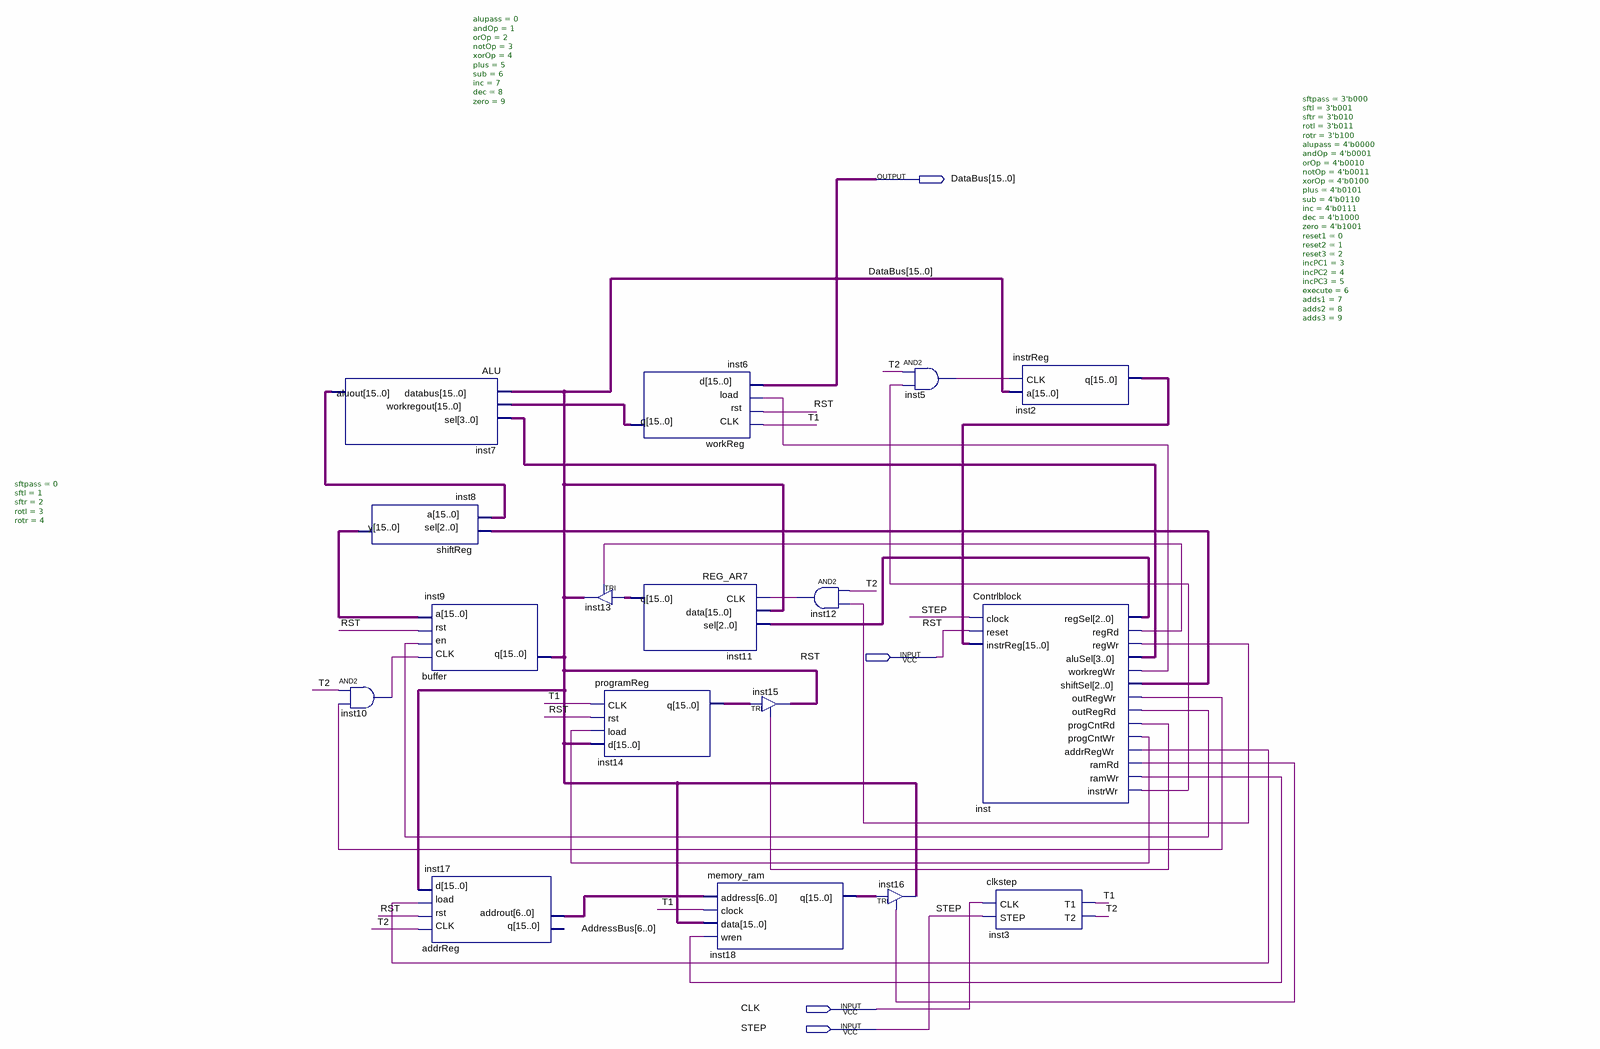
[diagram p0: schematic sheet]
// Quartus schematic CPU16bit(1).bdf as structural Verilog: 17 symbols, 4 pins
module \CPU16bit(1)  (
  input  RST,
  input  CLK,
  input  STEP,
  output [15:0] DataBus
);

  wire inst5_out, inst10_out, inst12_out, inst_addrregwr, inst_instrwr, inst_outregrd, inst_outregwr,
       inst_progcntrd, inst_progcntwr, inst_ramrd, inst_ramwr, inst_regrd, inst_regwr, inst_workregwr, T1, T2;
  wire [2:0] inst_regsel, inst_shiftsel;
  wire [3:0] inst_alusel;
  wire [6:0] AddressBus;
  wire [15:0] inst2_q, inst6_q, inst7_aluout, inst8_y, inst11_q, inst14_q, inst18_q;

  ALU #(.alupass(0), .andOp(1), .orOp(2), .notOp(3), .xorOp(4), .plus(5), .sub(6), .inc(7), .dec(8), .zero(9)) inst7 (
    .databus(DataBus), .workregout(inst6_q), .sel(inst_alusel), .aluout(inst7_aluout));
  shiftReg #(.sftpass(0), .sftl(1), .sftr(2), .rotl(3), .rotr(4)) inst8 (
    .sel(inst_shiftsel), .a(inst7_aluout), .y(inst8_y));
  and inst10 (inst10_out, T2, inst_outregwr);
  buffer inst9 (.CLK(inst10_out), .en(inst_outregrd), .rst(RST), .a(inst8_y), .q(DataBus));
  addrReg inst17 (.CLK(T2), .rst(RST), .load(inst_addrregwr), .d(DataBus), .addrout(AddressBus));  // open: q
  TRI inst13[15:0] (.IN(inst11_q), .OE(inst_regrd), .OUT(DataBus));
  programReg inst14 (.CLK(T1), .rst(RST), .load(inst_progcntwr), .d(DataBus), .q(inst14_q));
  workReg inst6 (.CLK(T1), .rst(RST), .load(inst_workregwr), .d(DataBus), .q(inst6_q));
  REG_AR7 inst11 (.CLK(inst12_out), .data(DataBus), .sel(inst_regsel), .q(inst11_q));
  memory_ram inst18 (.address(AddressBus), .clock(T1), .data(DataBus), .wren(inst_ramwr), .q(inst18_q));
  TRI inst15[15:0] (.IN(inst14_q), .OE(inst_progcntrd), .OUT(DataBus));
  and inst12 (inst12_out, T2, inst_regwr);
  and inst5 (inst5_out, T2, inst_instrwr);
  TRI inst16[15:0] (.IN(inst18_q), .OE(inst_ramrd), .OUT(DataBus));
  Contrlblock #(.sftpass(3'b000), .sftl(3'b001), .sftr(3'b010), .rotl(3'b011), .rotr(3'b100), .alupass(4'b0000), .andOp(4'b0001), .orOp(4'b0010), .notOp(4'b0011), .xorOp(4'b0100), .plus(4'b0101), .sub(4'b0110), .inc(4'b0111), .dec(4'b1000), .zero(4'b1001), .reset1(0), .reset2(1), .reset3(2), .incPC1(3), .incPC2(4), .incPC3(5), .execute(6), .adds1(7), .adds2(8), .adds3(9)) inst (
    .clock(STEP), .reset(RST), .instrReg(inst2_q), .regSel(inst_regsel), .regRd(inst_regrd),
    .regWr(inst_regwr), .aluSel(inst_alusel), .workregWr(inst_workregwr), .shiftSel(inst_shiftsel),
    .outRegWr(inst_outregwr), .outRegRd(inst_outregrd), .progCntRd(inst_progcntrd),
    .progCntWr(inst_progcntwr), .addrRegWr(inst_addrregwr), .ramRd(inst_ramrd), .ramWr(inst_ramwr),
    .instrWr(inst_instrwr));
  instrReg inst2 (.CLK(inst5_out), .a(DataBus), .q(inst2_q));
  clkstep inst3 (.CLK(CLK), .STEP(STEP), .T1(T1), .T2(T2));
endmodule
